# Altium schematic sheet top.SchDoc
size Letter; CompanyName: Brinton Engineering, LLC; Address1: 3479 Edison Way; Address2: Menlo Park CA 94025; Address3: +1 (877) 778-8435; Address4: brintonengineering.com; Revision: 1; SheetNumber: 1; SheetTotal: 1
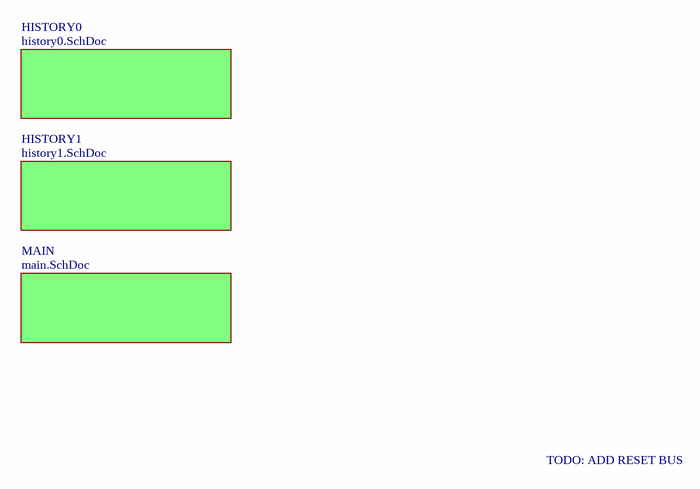
[diagram p0: top.SchDoc]

## Sub-sheets
HISTORY0 = history0.SchDoc: no entries
HISTORY1 = history1.SchDoc: no entries
MAIN = main.SchDoc: no entries

## Notes on the sheet
- TODO: ADD RESET BUS
- Title
- Engineer
- Revision
- Drawn By
- Checked By
- Date
- Sheet
- of